# EAGLE design mimic1575 (EAGLE 7.5.0)
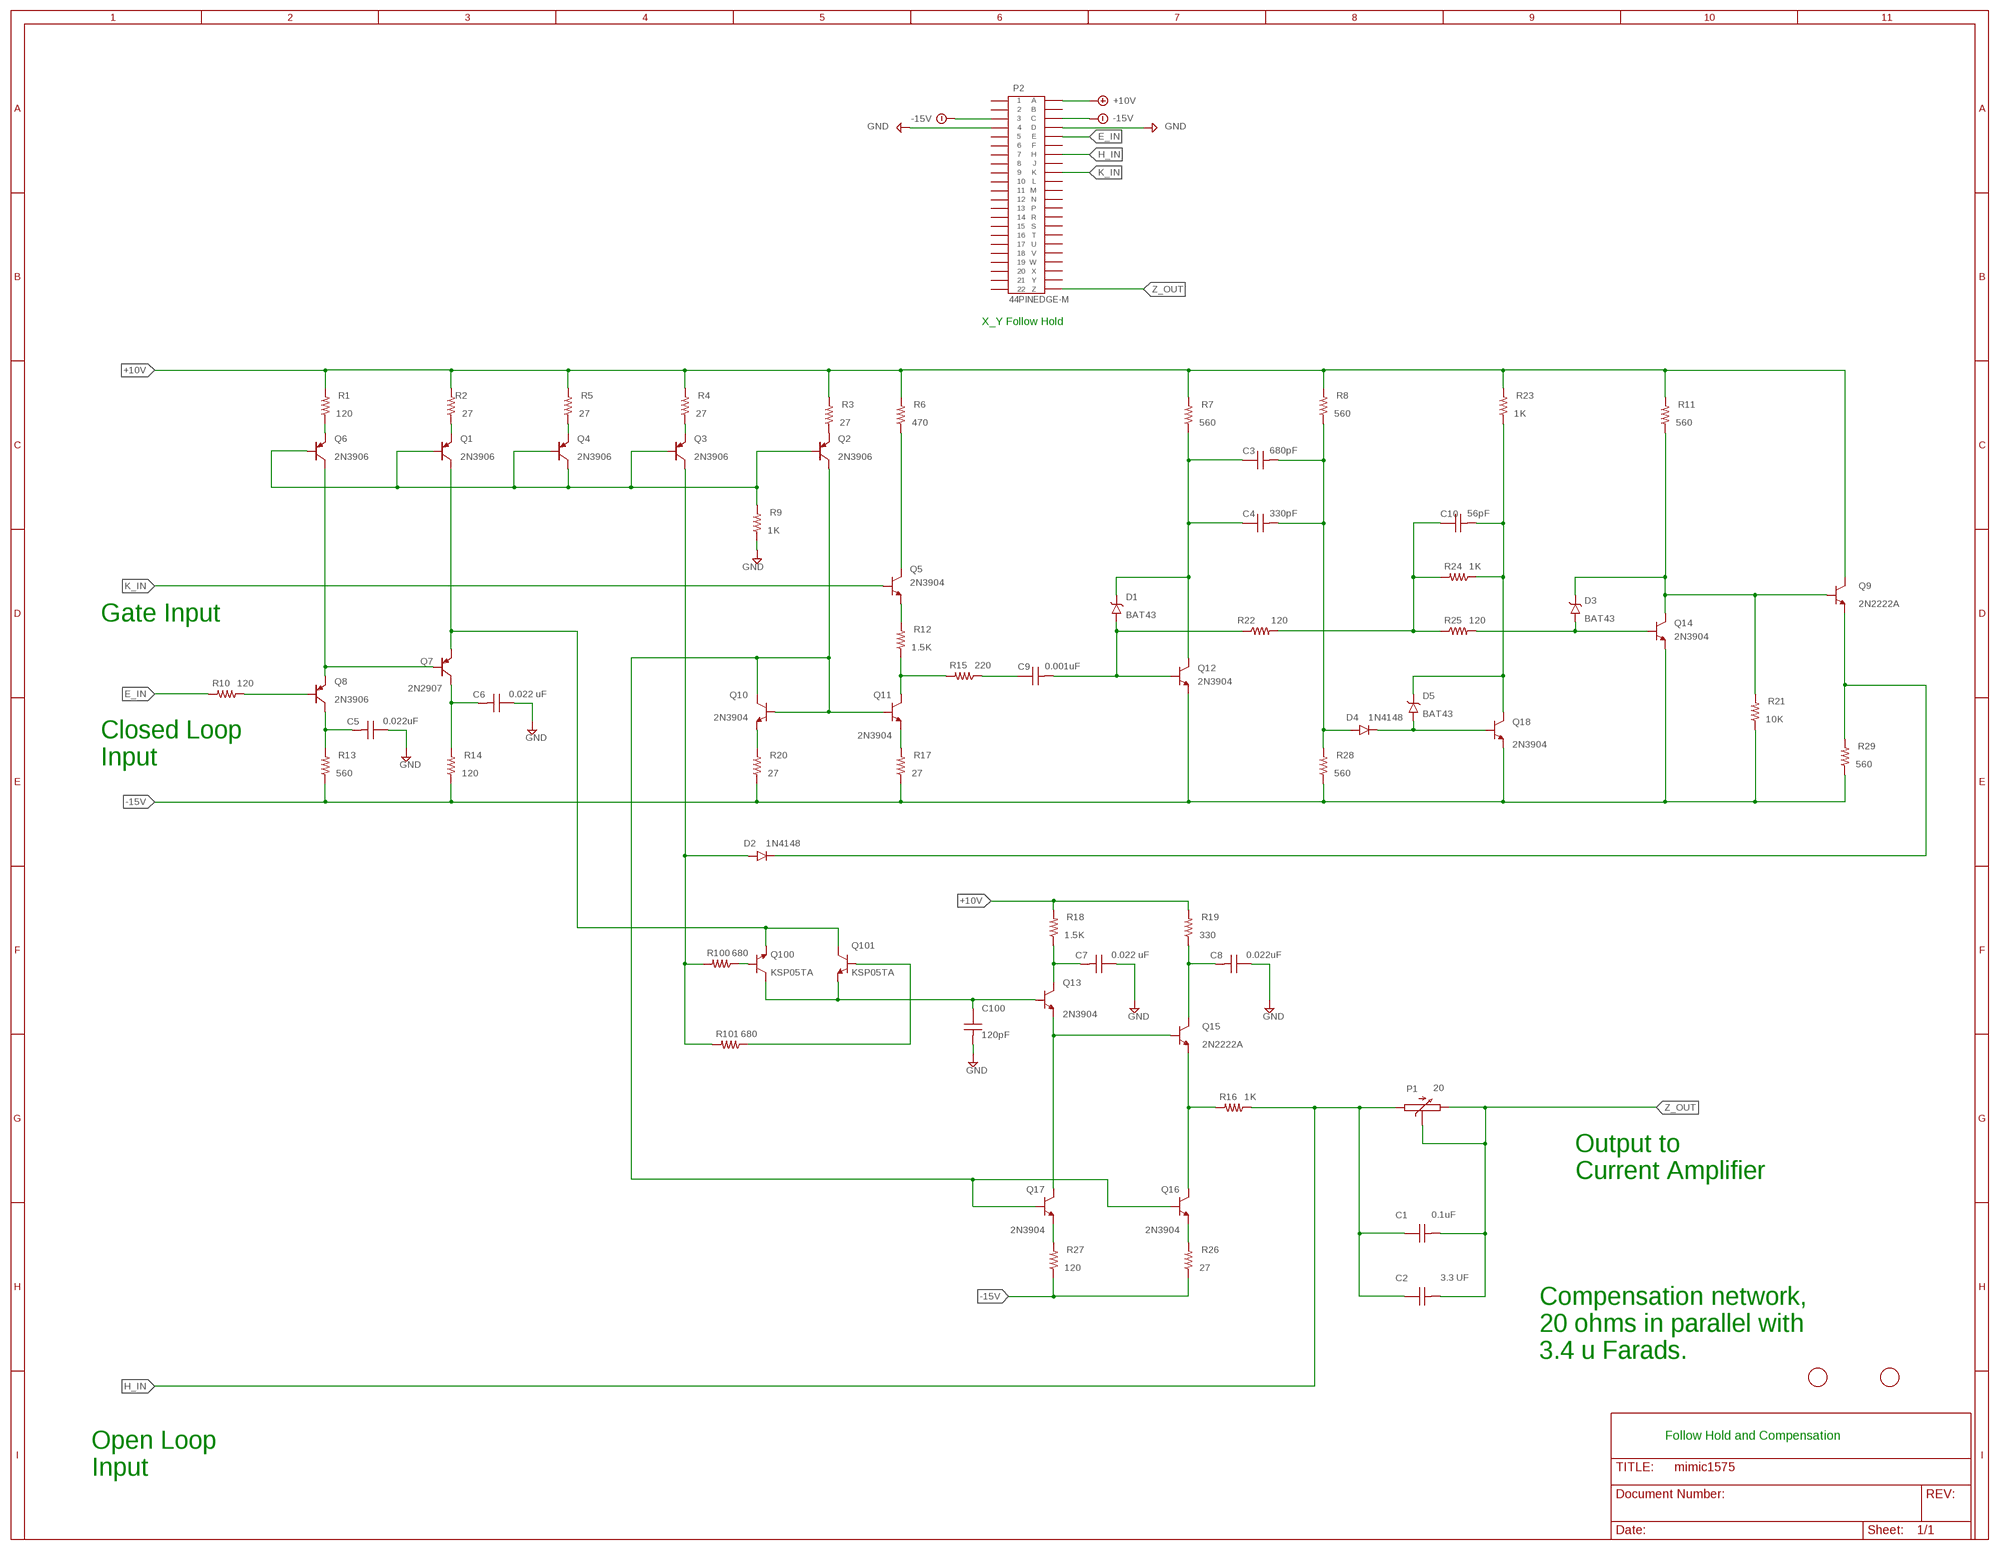
[diagram p0: schematic, sheet 1]

## Parts
C1  0.1uF  CAP0.1UF100V  [5MM_TH]
C2  3.3 UF  ECW-FD2W335K  [ECW-FD2W335K]
C3  680pF  CAP0.1UF100V  [5MM_TH]
C4  330pF  CAP0.1UF100V  [5MM_TH]
C5  0.022uF  ECQ-E2223JF  [CAP-ZERO-PT-ZERO-22UF-250V-FILM]
C6  0.022 uF  ECQ-E2223JF  [CAP-ZERO-PT-ZERO-22UF-250V-FILM]
C7  0.022 uF  ECQ-E2223JF  [CAP-ZERO-PT-ZERO-22UF-250V-FILM]
C8  0.022uF  ECQ-E2223JF  [CAP-ZERO-PT-ZERO-22UF-250V-FILM]
C9  0.001uF  CAP0.1UF100V  [5MM_TH]
C10  56pF  CAP0.1UF100V  [5MM_TH]
C100  120pF  CAP0.1UF100V  [5MM_TH]
D1  BAT43  1N754A  [DO35-7]
D2  1N4148  [DO35-7]
D3  BAT43  1N754A  [DO35-7]
D4  1N4148  [DO35-7]
D5  BAT43  1N754A  [DO35-7]
P1  20  POT-3006P  [3006P]
P2  44PINEDGE-M  [44PINEDGE]
Q1  2N3906  [TO92]
Q2  2N3906  [TO92]
Q3  2N3906  [TO92]
Q4  2N3906  [TO92]
Q5  2N3904  [TO92]
Q6  2N3906  [TO92]
Q7  2N2907  [TO18]
Q8  2N3906  [TO92]
Q9  2N2222A  [TO18]
Q10  2N3904  [TO92]
Q11  2N3904  [TO92]
Q12  2N3904  [TO92]
Q13  2N3904  [TO92]
Q14  2N3904  [TO92]
Q15  2N2222A  [TO18]
Q16  2N3904  [TO92]
Q17  2N3904  [TO92]
Q18  2N3904  [TO92]
Q100  KSP05TA  [TO92]
Q101  KSP05TA  [TO92]
R1  120  AXIALRESISTORQUARTER_WATT  [R_QUARTERWATT]
R2  27  AXIALRESISTORQUARTER_WATT  [R_QUARTERWATT]
R3  27  AXIALRESISTORQUARTER_WATT  [R_QUARTERWATT]
R4  27  AXIALRESISTORQUARTER_WATT  [R_QUARTERWATT]
R5  27  AXIALRESISTORQUARTER_WATT  [R_QUARTERWATT]
R6  470  AXIALRESISTORQUARTER_WATT  [R_QUARTERWATT]
R7  560  AXIALRESISTORQUARTER_WATT  [R_QUARTERWATT]
R8  560  AXIALRESISTORQUARTER_WATT  [R_QUARTERWATT]
R9  1K  AXIALRESISTORQUARTER_WATT  [R_QUARTERWATT]
R10  120  AXIALRESISTORQUARTER_WATT  [R_QUARTERWATT]
R11  560  AXIALRESISTORQUARTER_WATT  [R_QUARTERWATT]
R12  1.5K  AXIALRESISTORQUARTER_WATT  [R_QUARTERWATT]
R13  560  AXIALRESISTORQUARTER_WATT  [R_QUARTERWATT]
R14  120  AXIALRESISTORQUARTER_WATT  [R_QUARTERWATT]
R15  220  AXIALRESISTORQUARTER_WATT  [R_QUARTERWATT]
R16  1K  AXIALRESISTORQUARTER_WATT  [R_QUARTERWATT]
R17  27  AXIALRESISTORQUARTER_WATT  [R_QUARTERWATT]
R18  1.5K  AXIALRESISTORQUARTER_WATT  [R_QUARTERWATT]
R19  330  AXIALRESISTORQUARTER_WATT  [R_QUARTERWATT]
R20  27  AXIALRESISTORQUARTER_WATT  [R_QUARTERWATT]
R21  10K  AXIALRESISTORQUARTER_WATT  [R_QUARTERWATT]
R22  120  AXIALRESISTORQUARTER_WATT  [R_QUARTERWATT]
R23  1K  AXIALRESISTORQUARTER_WATT  [R_QUARTERWATT]
R24  1K  AXIALRESISTORQUARTER_WATT  [R_QUARTERWATT]
R25  120  AXIALRESISTORQUARTER_WATT  [R_QUARTERWATT]
R26  27  AXIALRESISTORQUARTER_WATT  [R_QUARTERWATT]
R27  120  AXIALRESISTORQUARTER_WATT  [R_QUARTERWATT]
R28  560  AXIALRESISTORQUARTER_WATT  [R_QUARTERWATT]
R29  560  AXIALRESISTORQUARTER_WATT  [R_QUARTERWATT]
R100  680  AXIALRESISTORQUARTER_WATT  [R_QUARTERWATT]
R101  680  AXIALRESISTORQUARTER_WATT  [R_QUARTERWATT]
U$1  FIDUCIAL  [FIDUCIAL_1MM]
U$2  FIDUCIAL  [FIDUCIAL_1MM]

## Nets
+10V: P2.A Q9.3(C) R1.2 R2.2 R3.2 R4.2 R5.2 R6.2 R7.2 R8.2 R11.2 R18.2 R19.2 R23.2
-15V: P2.3 P2.C Q12.1(E) Q14.1(E) Q18.1(E) R13.1 R14.1 R17.1 R20.1 R21.1 R26.1 R27.1 R28.1 R29.1
E_IN: P2.E R10.2
GND: C5.1 C6.1 C7.1 C8.1 C100.2 P2.4 P2.D R9.1
H_IN: C1.1 C2.1 P1.1 P2.H R16.1
K_IN: P2.K Q5.2(B)
N$1: C9.1 R15.1
N$2: C3.1 C4.1 D1.C Q12.3(C) R7.1
N$3: C9.2 D1.A Q12.2(B) R22.1
N$4: C10.1 R22.2 R24.2 R25.1
N$5: C10.2 D5.C Q18.3(C) R23.1 R24.1
N$6: D2.C Q9.1(E) R29.2
N$7: Q10.1(E) R20.2
N$8: D4.C D5.A Q18.2(B)
N$9: C3.2 C4.2 D4.A R8.1 R28.2
N$10: Q4.3(E) R5.1
N$11: D3.C Q9.2(B) Q14.3(C) R11.1 R21.2
N$12: D3.A Q14.2(B) R25.2
N$13: C6.2 Q7.3(C) R14.2
N$14: Q2.1(C) Q10.2(B) Q10.3(C) Q11.2(B) Q16.2(B) Q17.2(B)
N$15: Q1.1(C) Q7.1(E) Q100.1(E) Q101.3(C)
N$16: Q3.3(E) R4.1
N$17: Q100.2(B) R100.1
N$18: Q17.1(E) R27.2
N$19: Q101.2(B) R101.1
N$20: C100.1 Q13.2(B) Q100.3(C) Q101.1(E)
N$21: Q1.2(B) Q2.2(B) Q3.2(B) Q4.1(C) Q4.2(B) Q6.2(B) R9.2
N$22: Q13.1(E) Q15.2(B) Q17.3(C)
N$23: D2.A Q3.1(C) R100.2 R101.2
N$24: Q2.3(E) R3.1
N$25: Q8.2(B) R10.1
N$26: Q6.3(E) R1.1
N$27: C7.2 Q13.3(C) R18.1
N$28: Q11.1(E) R17.2
N$30: Q6.1(C) Q7.2(B) Q8.3(E)
N$31: C5.2 Q8.1(C) R13.2
N$33: Q1.3(E) R2.1
N$34: Q11.3(C) R12.1 R15.2
N$36: Q16.1(E) R26.2
N$37: Q5.1(E) R12.2
N$38: Q5.3(C) R6.1
N$39: Q15.1(E) Q16.3(C) R16.2
N$40: C8.2 Q15.3(C) R19.1
Z_OUT: C1.2 C2.2 P1.2 P1.3 P2.Z
Unconnected: P2.1 P2.2 P2.5 P2.6 P2.7 P2.8 P2.9 P2.10 P2.11 P2.12 P2.13 P2.14 P2.15 P2.16 P2.17 P2.18 P2.19 P2.20 P2.21 P2.22 P2.B P2.F P2.J P2.L P2.M P2.N P2.P P2.R P2.S P2.T P2.U P2.V P2.W P2.X P2.Y

## Notes on the sheet
- X_Y Follow Hold
- Gate Input
- Closed Loop 
  Input
- Output to
  Current Amplifier
- Compensation network,
  20 ohms in parallel with 
  3.4 u Farads.
- Follow Hold and Compensation
- Open Loop 
  Input

## Library data of the parts
C1 = keiths:CAP0.1UF100V: 0.1µF ±10% 100V Ceramic X8R TH; MPN: FA26X8R2A104KNU06
C2 = keiths:ECW-FD2W335K: CAP FILM 3.3UF 10% 450VDC RADIAL
C3 C4 C9 C100 = keiths:CAP0.1UF100V: 0.1µF ±10% 100V Ceramic X8R TH; MPN: 1000 pf; VALUE: 0.1uF
C5-C8 = keiths:ECQ-E2223JF: FILM CAPACITOR, 0.022UF, 250V, 5%, RADIAL Capacitor Dielectric Type:PET (Polyester) Lead Spacing:10mm; PN: ECQ-E2223JFB
C10 = keiths:CAP0.1UF100V: 0.1µF ±10% 100V Ceramic X8R TH; MPN: 68 pF; VALUE: 0.1uF
D1 D5 = keiths:1N754A: Zener diode 500mW, 5% TOLERANCE; PN: BAT43
D2 D4 = keiths:1N4148: High Conductance Fast Diode
D3 = keiths:1N754A: Zener diode 500mW, 5% TOLERANCE
P1 = keiths:POT-3006P: 3006 - Trimpot® Trimming Potentiometer. Clockwise turn moves wiper to pin 3
P2 = keiths:44PINEDGE-M: 44 PIN EDGE CONNECTOR FOR PCB
Q1-Q4 Q6 Q8 = keiths:2N3906: PNP Transistor
Q5 Q10-Q14 Q16-Q18 = keiths:2N3904: NPN Transistor; PN: 2N3904
Q7 = keiths:2N2907: The 2N2907 is a commonly available PNP bipolar junction transistor used for general purpose low-power amplifying or switching applications. It is designed for low to medium current, low power, medium voltage, and can operate at moderately high speeds.; PN: 2N2907A
Q9 Q15 = keiths:2N2222: NPN Transistor
Q100 Q101 = keiths:KSP05TA: NPN epitxial transistor. Low CE saturation.
R1-R29 R100 R101 = keiths:AXIALRESISTOR: Through hole axial leaded resistors.
U$1 U$2 = adafruit:FIDUCIAL: For use by pick and place machines to calibrate the vision/machine, 1mm By microbuilder.eu

## Board
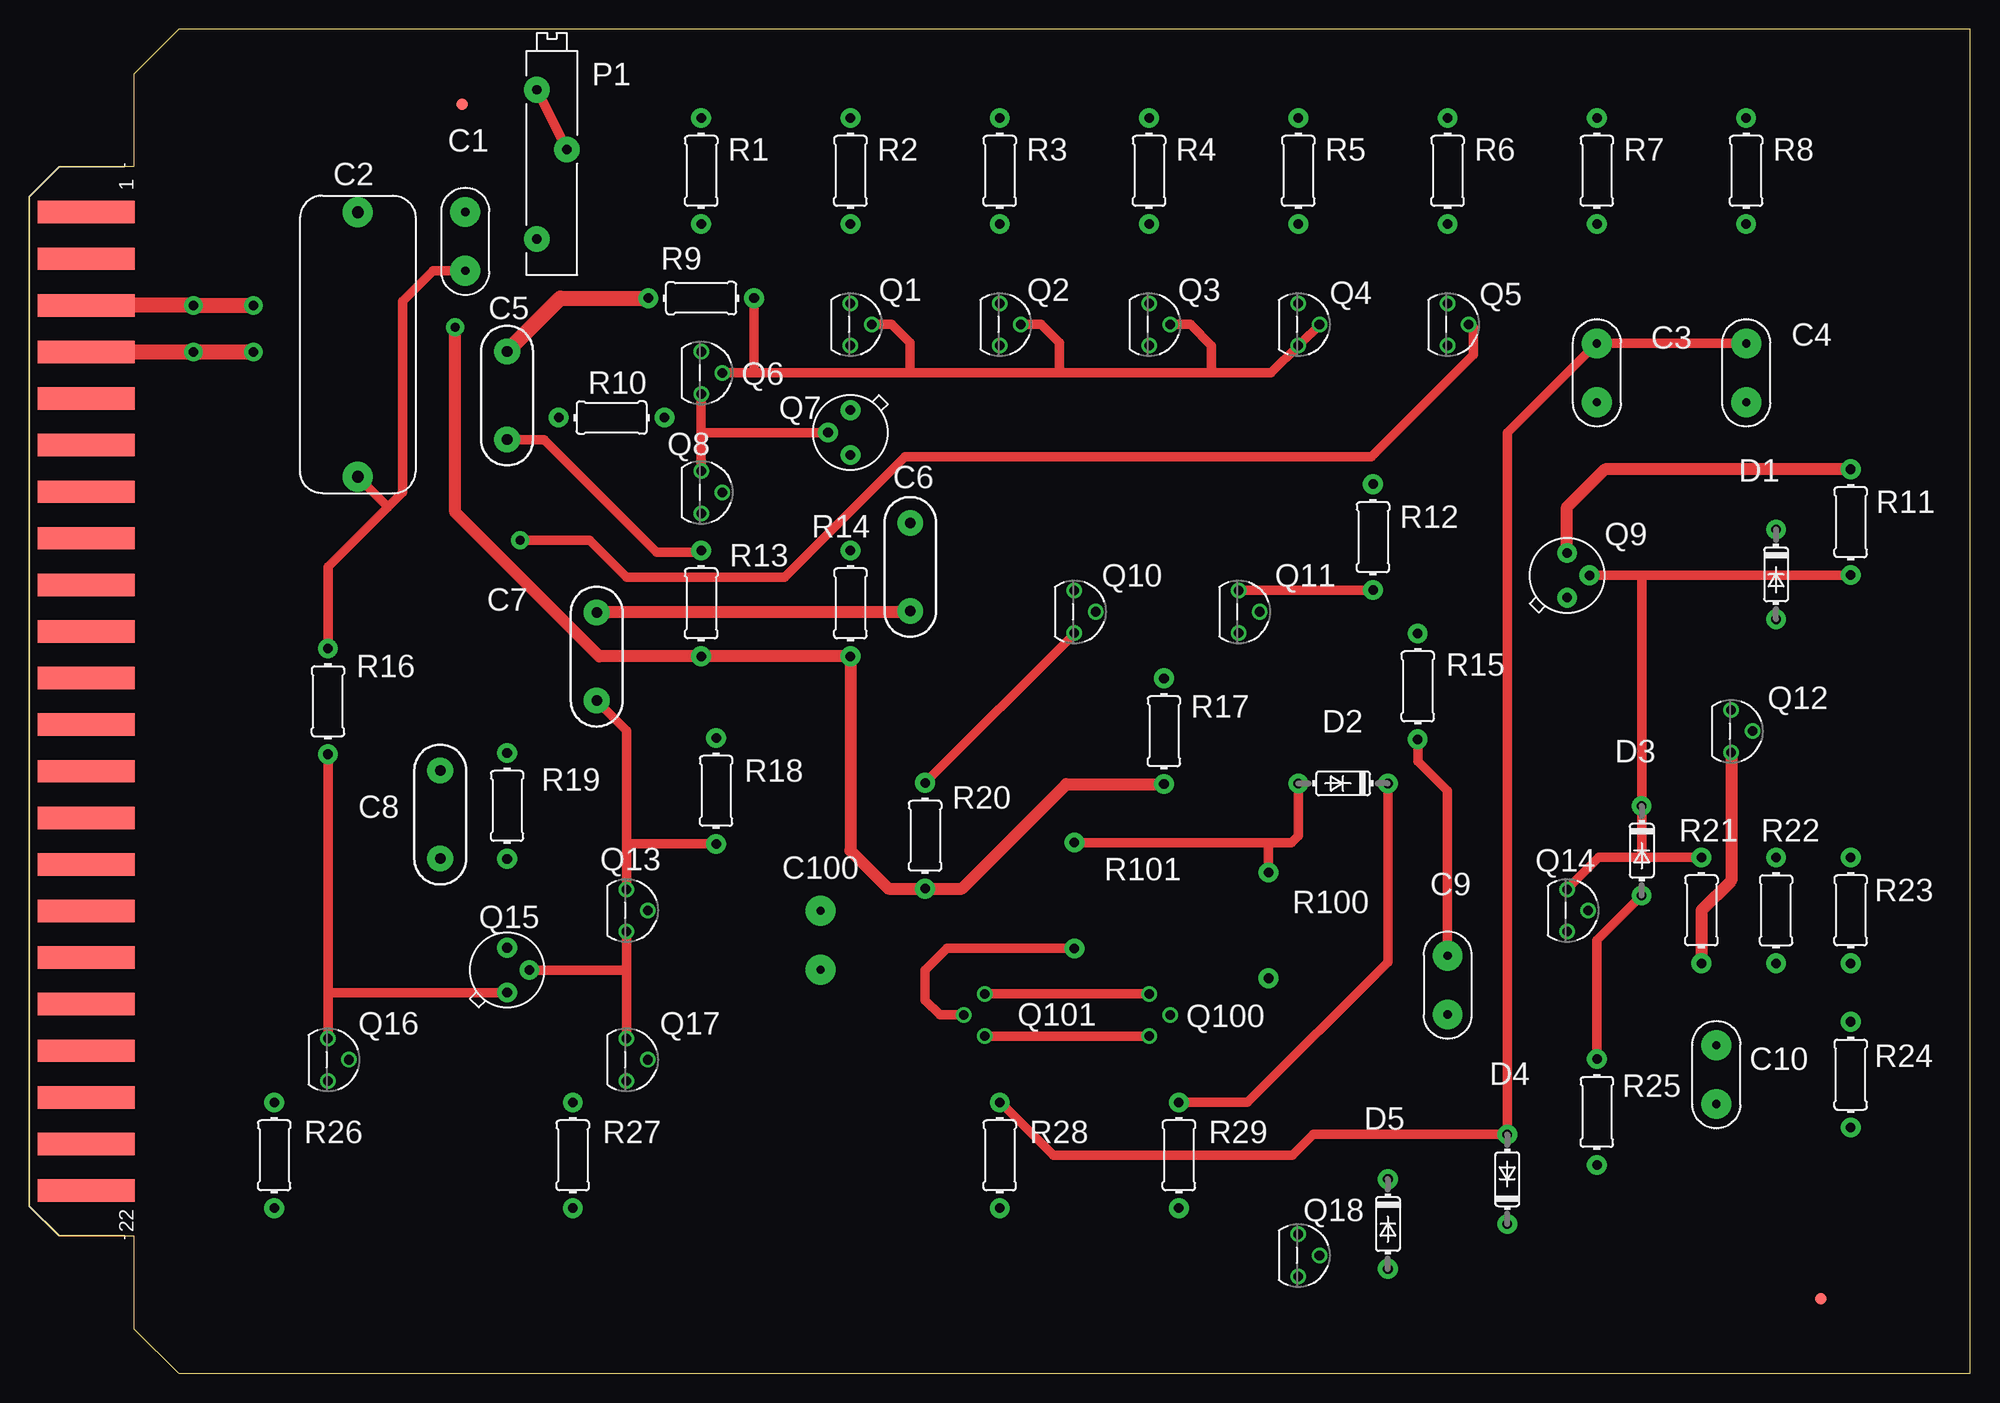
[diagram p1: board, top side]
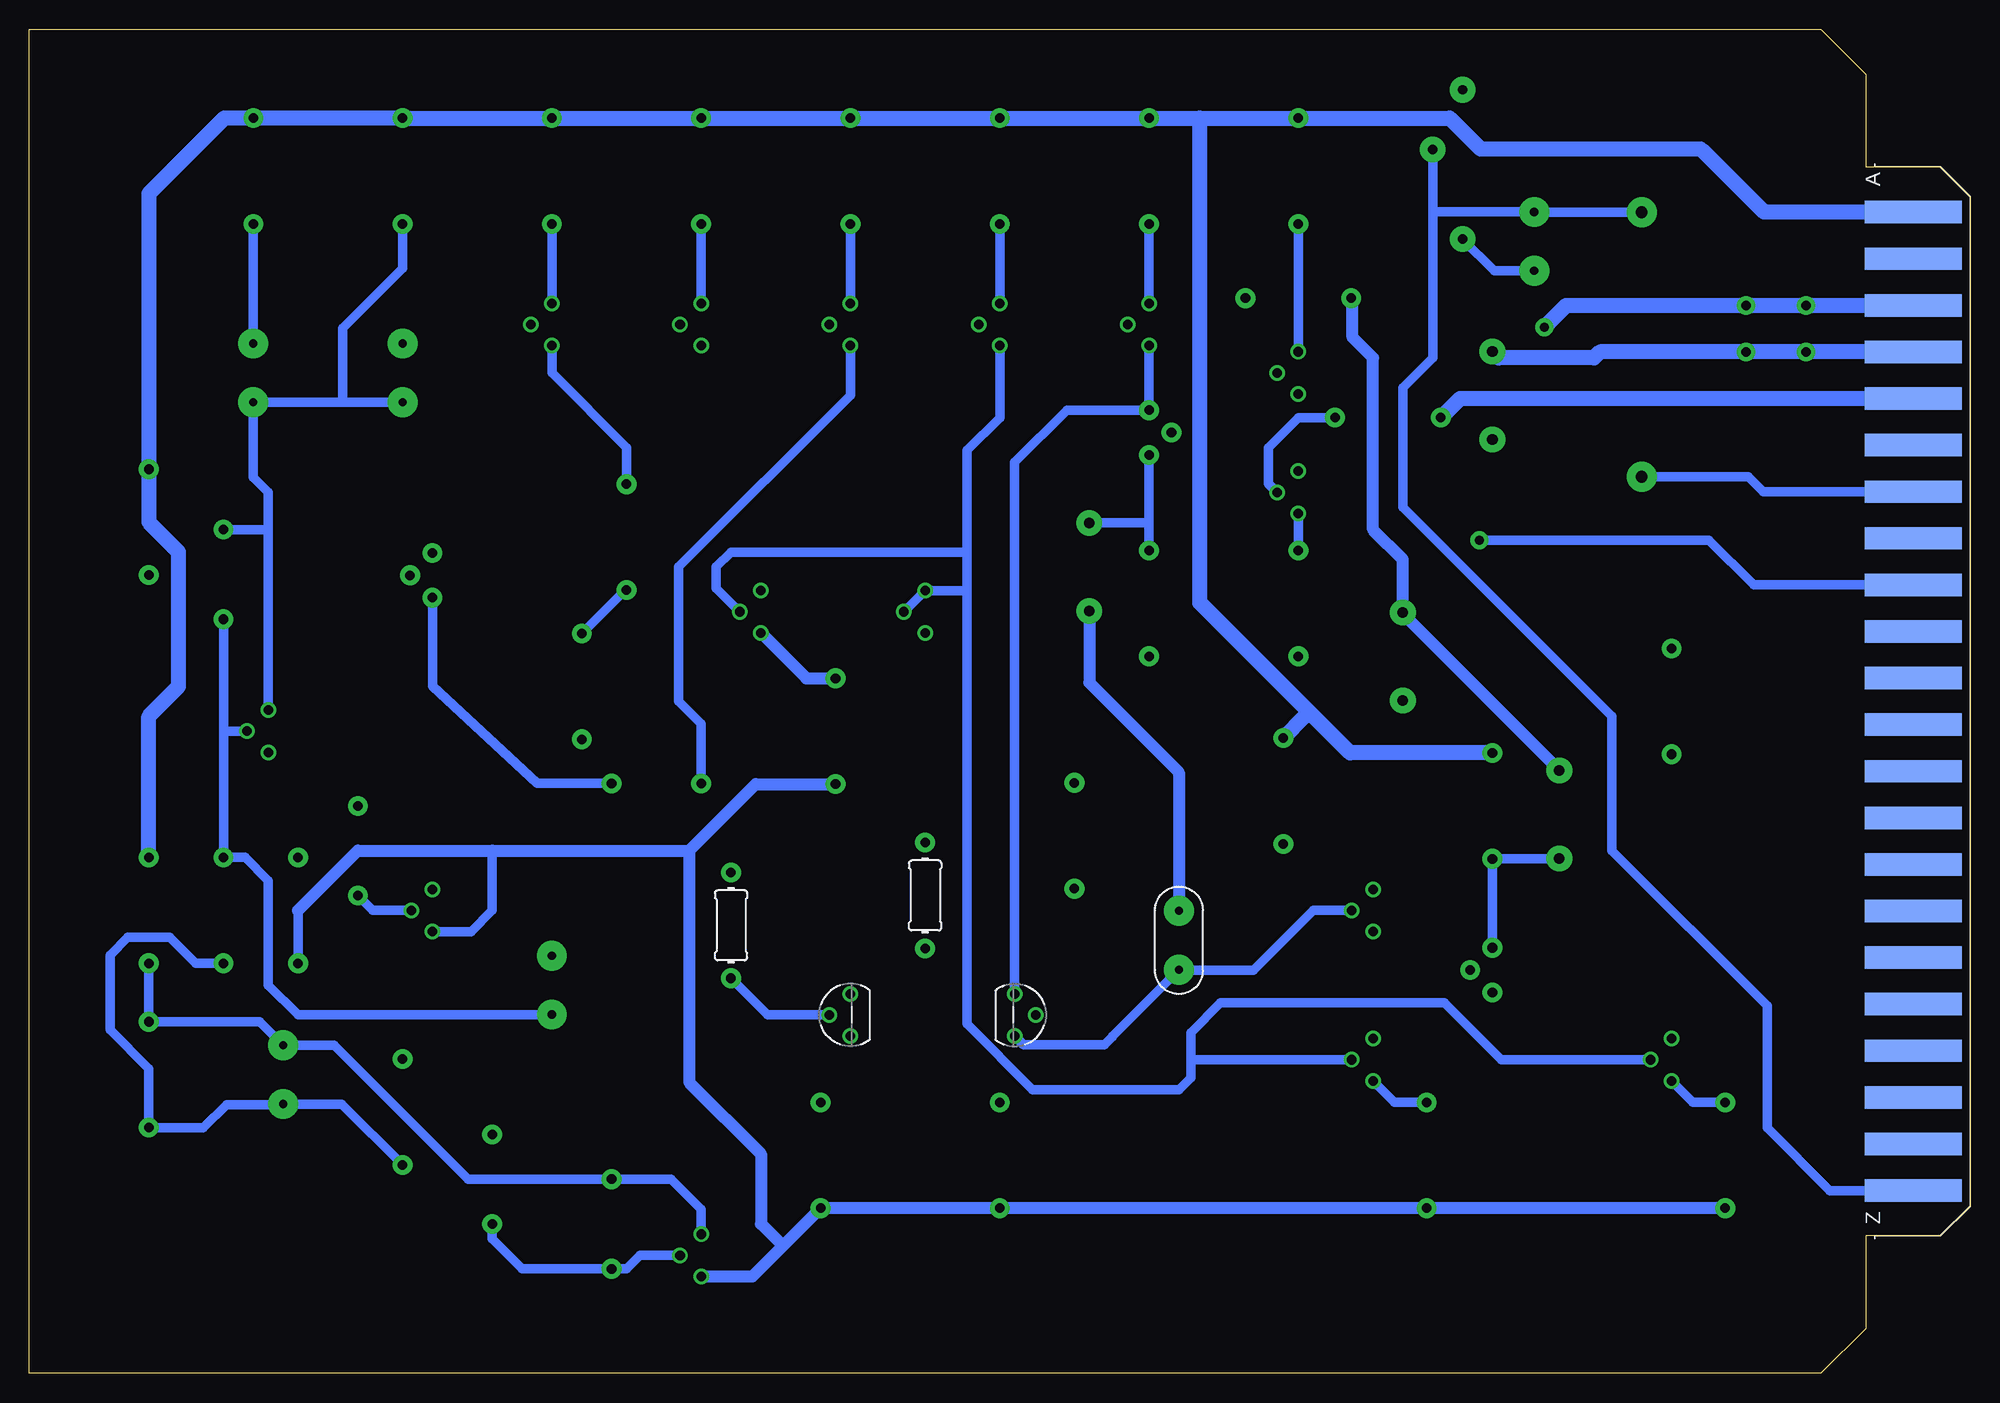
[diagram p2: board, bottom side, seen from below]

Size 165.1 x 114.3 mm. Coordinates in mm from the lower left corner, seen from the top.
Outline: 2.54,11.68 8.89,11.68 8.89,3.81 12.7,0 165.1,0 165.1,114.3 12.7,114.3 8.89,110.49 8.89,102.62 2.54,102.62 0,100.08 0,14.22 2.54,11.68
Copper layers (1*16): Top 0.035mm / dielectric 1.5mm / Bottom 0.035mm
Design rules "throughhole *": minimum track width 32mil, minimum drill 26mil, track to track 30mil, track to pad 30mil, pad to pad 30mil, via to via 30mil, smd to smd 30mil, copper to edge 20mil, drill to drill 20mil, minimum pad ring 10mil, minimum via ring 15mil, stop-mask expansion 4mil, vias tented up to drill 0mil, thermal gap 10mil

### Footprints (pad centres in the part's own frame; a part is rotated, then mirrored left to right if it is on the bottom)
5MM_TH = drill 0.7 pad 2.54: 1 -2.5,0; 2 2.5,0
ECW-FD2W335K = drill 1 pad 2.54: 1 -11.25,0; 2 11.25,0
CAP-ZERO-PT-ZERO-22UF-250V-FILM = drill 0.9 pad 2.184: 1 -3.75,0; 2 3.75,0
DO35-7 = drill 0.813 pad 1.676: A 0,-3.81; C 0,3.81
3006P = drill 0.8 pad 2.184: 1 -6.477,1.27; 2 1.143,-1.27; 3 6.223,1.27
44PINEDGE = smd 1.905 x 8.255: 1 -41.605,4.826; 2 -37.643,4.826; 3 -33.68,4.826; 4 -29.718,4.826; 5 -25.756,4.826; 6 -21.793,4.826; 7 -17.831,4.826; 8 -13.868,4.826; 9 -9.906,4.826; 10 -5.944,4.826; 11 -1.981,4.826; 12 1.981,4.826; 13 5.944,4.826; 14 9.906,4.826; 15 13.868,4.826; 16 17.831,4.826; 17 21.793,4.826; 18 25.756,4.826; 19 29.718,4.826; 20 33.68,4.826; 21 37.643,4.826; 22 41.605,4.826 | smd 1.905 x 8.255 bottom: A -41.605,4.826; B -37.643,4.826; C -33.68,4.826; D -29.718,4.826; E -25.756,4.826; F -21.793,4.826; H -17.831,4.826; J -13.868,4.826; K -9.906,4.826; L -5.944,4.826; M -1.981,4.826; N 1.981,4.826; P 5.944,4.826; R 9.906,4.826; S 13.868,4.826; T 17.831,4.826; U 21.793,4.826; V 25.756,4.826; W 29.718,4.826; X 33.68,4.826; Y 37.643,4.826; Z 41.605,4.826
TO92 = drill 0.813: 1 1.27,-1.27; 2 1.27,1.27; 3 -1.27,1.27
TO18 = drill 0.813 pad 1.676: 1 1.905,0; 2 0,1.905; 3 -1.905,0
R_QUARTERWATT = drill 0.813 pad 1.676: 1 -4.5,0; 2 4.5,0
FIDUCIAL_1MM = smd 1 x 1: 1 0,0

### Placement (x,y rotation side)
C1  37.08,96.27 90 top
C2  27.94,87.5 90 top
C3  133.35,85.09 90 top
C4  146.05,85.09 90 top
C5  40.64,83.16 270 top
C6  74.93,68.58 90 top
C7  48.26,60.96 270 top
C8  34.95,47.52 270 top
C9  120.65,33.02 270 top
C10  143.51,25.4 90 top
C100  67.31,36.83 90 bottom
D1  148.59,67.94 0 top
D2  111.76,50.16 270 top
D3  137.16,44.45 0 top
D4  125.73,16.51 180 top
D5  115.57,12.7 0 top
P1  44.45,102.95 90 top
P2  0,57.15 270 top
Q1  69.85,89.2 315 top
Q2  82.55,89.2 315 top
Q3  95.25,89.2 315 top
Q4  107.95,89.2 315 top
Q5  120.65,89.2 315 top
Q6  57.15,85.09 315 top
Q7  69.85,80.01 90 top
Q8  57.15,74.93 315 top
Q9  130.81,67.87 270 top
Q10  88.9,64.77 315 top
Q11  102.87,64.77 315 top
Q12  144.78,54.61 315 top
Q13  50.8,39.37 315 top
Q14  130.81,39.37 315 top
Q15  40.64,34.29 270 top
Q16  25.4,26.67 315 top
Q17  50.8,26.67 315 top
Q18  107.95,10.03 315 top
Q100  95.25,30.48 135 bottom
Q101  81.28,30.48 315 bottom
R1  57.15,102.26 90 top
R2  69.85,102.26 90 top
R3  82.55,102.26 90 top
R4  95.25,102.26 90 top
R5  107.95,102.26 90 top
R6  120.65,102.26 90 top
R7  133.35,102.26 90 top
R8  146.05,102.26 90 top
R9  57.15,91.44 0 top
R10  49.53,81.28 180 top
R11  154.94,72.39 90 top
R12  114.3,71.12 90 top
R13  57.15,65.48 90 top
R14  69.85,65.48 90 top
R15  118.11,58.42 90 top
R16  25.4,57.15 270 top
R17  96.52,54.61 90 top
R18  58.42,49.53 90 top
R19  40.64,48.26 90 top
R20  76.2,45.72 90 top
R21  142.24,39.37 90 top
R22  148.59,39.37 270 top
R23  154.94,39.37 90 top
R24  154.94,25.4 270 top
R25  133.35,22.23 90 top
R26  20.83,18.54 90 top
R27  46.23,18.54 90 top
R28  82.55,18.54 90 top
R29  97.79,18.54 90 top
R100  105.41,38.1 90 bottom
R101  88.9,40.64 90 bottom
U$1  36.83,107.95 0 top
U$2  152.4,6.35 0 top

### Tracks (layer width: path | path; a pad name or v marks a point on that pad's centre or on a via)
+10V
  Top 1.016: Q9.3 130.81,73.66 134.04,76.89 R11.2
  Bottom 0.813: R3.2 R4.2 | 56.57,55.88 55.88,55.88 | 22.91,104.14 22.76,103.99
  Bottom 1.27: 22.76,103.99 17.53,98.75 P2.A | R3.2 R5.2 R6.2 R7.2 R8.2 148.51,106.76 154.94,100.33 R11.2 154.94,72.39 152.4,69.85 152.4,58.42 154.94,55.88 R23.2 | R4.2 R2.2 65.53,106.76 | 65.53,106.76 R1.2 44.28,106.76 41.66,104.14 22.91,104.14 | 65.53,106.76 65.53,65.53 55.88,55.88 52.76,52.76 R19.2 | R18.2 56.57,55.88
-15V  (via drill 0.76, 0.8)
  Top 0.813: 5.51,91.34 P2.C
  Top 1.016: Q12.1 144.78,41.91 142.24,39.37 R21.1 | v36.22,88.98 36.22,73.23 48.47,60.98 R13.1 R14.1 69.85,44.45 73.08,41.22 R20.1 79.32,41.22 88.21,50.11 R17.1
  Top 1.27: P2.C v13.97,90.83 v19.05,90.83
  Bottom 0.813: Q14.1 127.53,37.57 125.73,39.37 125.73,44.45 | R21.1 142.24,39.37
  Bottom 1.016: 108.97,44.45 108.97,24.77 102.87,18.67 102.87,12.7 101,10.83 | 108.97,44.45 125.73,44.45 137.16,44.45 142.24,39.37 | R26.1 R27.1 R28.1 R29.1 101,10.83 | Q18.1 103.59,8.24 101,10.83 | 108.97,44.45 103.31,50.11 R17.1
  Bottom 1.27: v36.22,88.98 34.37,90.83 v19.05,90.83 P2.C
E_IN
  Bottom 1.27: P2.E 43.4,82.91 R10.2
GND  (via drill 0.8)
  Top 0.813: 74.93,64.77 C6.1 | 48.26,64.77 C7.1
  Top 1.016: 48.26,64.77 74.93,64.77
  Top 1.27: C5.1 45.17,91.44 R9.1 | P2.4 v13.97,86.87 v19.05,86.87
  Bottom 0.813: 48.26,64.61 C7.1 48.26,64.93 | 52.55,91.44 R9.1
  Bottom 1.016: C100.2 67.31,51.12 74.93,58.74 C6.1 | 52.55,91.44 52.55,88.11 50.8,86.36 50.8,71.75 48.26,69.22 48.26,64.93 | 48.26,64.61 C8.1
  Bottom 1.27: C5.1 40.09,86.36 32,86.36 31.5,86.87 v19.05,86.87 v13.97,86.87 P2.4
H_IN
  Top 0.813: R16.1 25.4,68.58 30.48,73.66 | 30.48,73.66 31.75,74.93 31.75,91.19 34.33,93.77 C1.1 | C2.1 30.48,73.71 30.48,73.66
  Bottom 0.813: C2.1 18.85,76.25 17.58,74.98 P2.H | C1.1 40.48,93.77 P1.1
K_IN  (via drill 0.76)
  Top 0.813: Q5.2 122.83,88.98 122.83,86.61 114.17,77.95 74.5,77.95 64.26,67.72 50.8,67.72 47.65,70.87 v41.73,70.87
  Bottom 0.813: v41.73,70.87 22.23,70.87 18.41,67.06 P2.K
N$1
  Top 0.813: C9.1 120.65,49.53 118.11,52.07 R15.1
N$2
  Bottom 0.813: 144.78,71.75 144.78,74.93 146.05,76.2 C4.1 138.43,82.59 | 144.78,71.75 Q12.3 | D1.C 144.78,71.75 | 138.43,82.59 C3.1 | R7.1 133.35,93.98 138.43,88.9 138.43,82.59
N$3
  Bottom 0.813: D1.A 148.59,54.61 | 148.59,54.61 R22.1 146.74,43.87 144.78,41.91 144.78,33.02 142.24,30.48 120.69,30.48 C9.2 | Q12.2 148.59,54.61
N$4
  Bottom 0.813: R25.1 138.53,22.9 C10.1 143.55,22.86 148.34,22.86 150.3,20.9 R24.2 154.94,25.91 158.24,29.21 158.24,35.56 156.72,37.08 153.16,37.08 150.95,34.87 R22.2
N$5
  Bottom 0.813: Q18.3 107.95,13.97 110.49,16.51 D5.C 127.76,16.51 139.15,27.9 C10.2 145.51,29.9 R24.1 R23.1
N$6
  Top 0.813: D2.C 115.57,34.98 103.63,23.04 R29.2
  Bottom 0.813: Q9.1 130.81,58.42 121.92,50.16 D2.C
N$7
  Top 0.813: R20.2 88.9,62.92 Q10.1
N$8
  Bottom 0.813: D4.C 125.73,11.43 123.19,8.89 D5.A 114.3,8.89 113.16,10.03 Q18.2
N$9
  Top 0.813: C4.2 C3.2 125.75,79.99 | 125.75,79.99 125.73,79.97 | 125.75,79.99 125.73,80.01 D4.A 109.22,20.32 107.44,18.54 87.12,18.54 82.62,23.04 R28.2
  Bottom 0.813: R8.1 C4.2
N$10
  Bottom 0.813: Q4.3 R5.1
N$11
  Top 0.813: Q9.2 137.16,67.87 | 137.16,67.87 152.38,67.87 R11.1 | 137.16,67.87 D3.C 137.16,43.87 | Q14.3 133.51,43.87 137.16,43.87 | 137.16,43.87 R21.2
N$12
  Top 0.813: R25.2 133.35,36.83 D3.A
  Bottom 0.813: D3.A 135.89,39.37 Q14.2
N$13
  Bottom 0.813: Q7.3 69.85,72.39 | 69.85,72.39 R14.2 | C6.2 69.91,72.33 69.85,72.39
N$14
  Bottom 0.813: Q16.2 39.88,26.67 44.7,31.5 63.75,31.5 66.29,28.96 66.29,26.67 | 85.34,66.57 85.34,29.72 79.76,24.13 67.31,24.13 66.29,25.15 66.29,26.67 | Q2.1 82.55,81.28 85.34,78.49 85.34,69.85 | 85.34,66.57 85.34,69.85 | 85.34,66.57 Q10.3 Q10.2 | Q11.2 106.68,66.78 106.68,68.58 105.41,69.85 85.34,69.85 | 66.29,26.67 Q17.2
N$15
  Top 0.813: Q101.3 Q100.1
  Bottom 0.813: Q101.3 81.28,77.47 76.83,81.92 Q7.1 Q1.1
N$16
  Bottom 0.813: R4.1 Q3.3
N$17
  Bottom 0.813: R100.1 102.29,30.48 Q100.2
N$18
  Bottom 0.813: Q17.1 48.97,23.04 R27.2
N$19
  Top 0.813: Q101.2 77.47,30.48 76.2,31.75 76.2,34.29 78.05,36.14 R101.1
N$20
  Top 0.813: Q101.1 Q100.3
  Bottom 0.813: Q13.2 55.88,39.37 60.96,34.29 67.27,34.29 C100.1 72.96,28.68 72.96,28.64 73.66,27.94 80.54,27.94 Q101.1
N$21
  Top 0.813: Q4.2 109.73,89.15 108.2,87.63 Q4.1 105.63,85.09 100.33,85.09 | 100.33,85.09 100.55,85.31 100.55,87.41 98.75,89.2 Q3.2 | 87.63,85.09 100.33,85.09 | 87.63,85.09 87.63,87.63 86.06,89.2 Q2.2 | 74.93,85.09 87.63,85.09 | Q1.2 73.36,89.2 74.93,87.63 74.93,85.09 | Q6.2 61.65,85.09 | 61.65,85.09 74.93,85.09 | R9.2 61.65,85.09
N$22
  Top 0.813: Q17.3 50.8,34.29 | 50.8,34.29 Q13.1 | Q15.2 50.8,34.29
N$23
  Top 0.813: R101.2 105.41,45.14 | 105.41,45.14 107.37,45.14 107.95,45.72 D2.A | R100.2 105.41,45.14
  Bottom 0.813: Q3.1 95.25,83.19 109.86,68.58 109.86,57.15 107.95,55.24 D2.A
N$24
  Bottom 0.813: Q2.3 R3.1
N$25
  Bottom 0.813: Q8.2 59.69,75.67 59.69,78.74 57.15,81.28 R10.1
N$26
  Bottom 0.813: R1.1 Q6.3
N$27
  Top 0.813: C7.2 50.8,54.67 50.8,45.03 | 50.8,45.03 Q13.3 | R18.1 50.8,45.03
N$28
  Bottom 1.016: Q11.1 99.01,59.11 R17.2
N$30
  Top 0.813: Q8.3 57.15,80.01 | 57.15,80.01 Q6.1 | Q7.2 57.15,80.01
N$31
  Top 0.813: C5.2 43.78,79.41 53.34,69.85 57.02,69.85 R13.2
  Bottom 0.813: R13.2 Q8.1
N$33
  Bottom 0.813: R2.1 Q1.3
N$34
  Top 0.813: R12.1 102.92,66.62 Q11.3
  Bottom 0.813: R15.2 114.41,66.62 R12.1
N$36
  Bottom 0.813: R26.2 23.57,23.04 Q16.1
N$37
  Bottom 0.813: R12.2 114.3,78.74 120.65,85.09 Q5.1
N$38
  Bottom 0.813: Q5.3 R6.1
N$39
  Top 0.813: R16.2 25.4,32.38 | 25.4,32.38 Q16.3 | Q15.1 25.4,32.38
N$40
  Bottom 0.813: C8.2 R19.1 Q15.3
Z_OUT
  Top 0.813: P1.2 P1.3
  Bottom 0.813: P1.2 45.72,98.81 | 45.72,98.81 45.72,86.36 48.26,83.82 48.26,73.66 30.48,55.88 30.48,44.45 17.27,31.24 17.27,20.88 11.94,15.54 P2.Z | 45.72,98.81 37.12,98.81 C1.2 27.95,98.77 C2.2

### Text on the board
logo: board type 1575 / follow hold